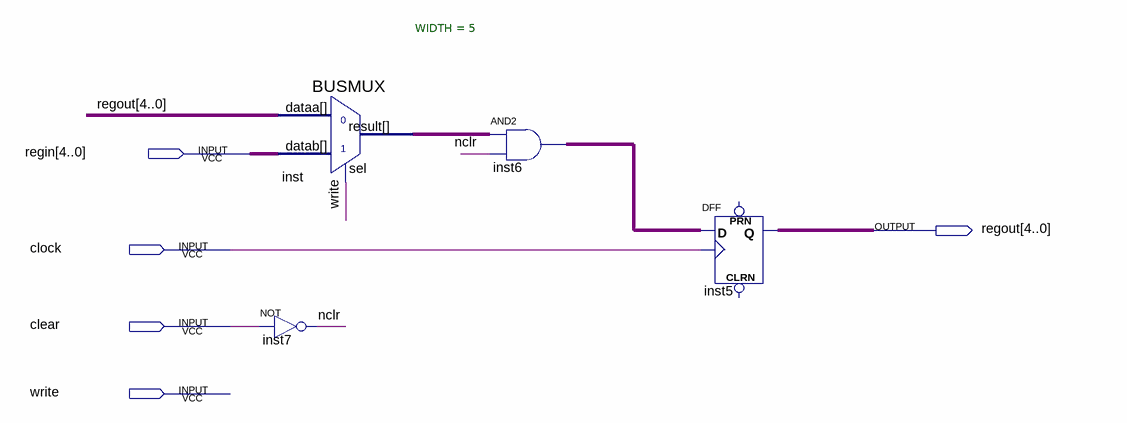
[diagram p0: schematic sheet]
// Quartus schematic Register5.bdf as structural Verilog: 4 symbols, 5 pins
module Register5 (
  input  [4:0] regin,
  input  clock,
  input  clear,
  input  write,
  output [4:0] regout
);

  wire nclr;
  wire [4:0] inst6_out, inst_result;

  not inst7 (nclr, clear);
  BUSMUX #(.WIDTH(5)) inst (.datab(regin), .sel(write), .dataa(regout), .result(inst_result));
  assign inst6_out = inst_result & {5{nclr}};  // AND2 inst6, 5 bits wide
  DFF inst5[4:0] (.CLK(clock), .D(inst6_out), .Q(regout));  // open: CLRN, PRN
endmodule
